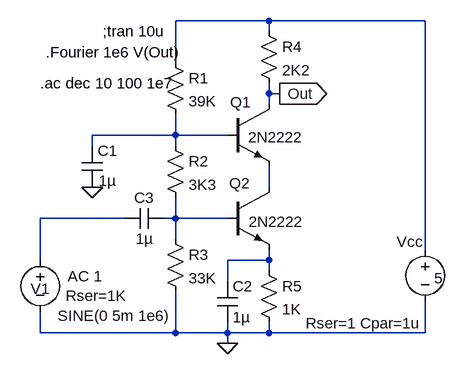
[diagram p0: schematic CascodAmp.asc]
CascodAmp.asc, the LTspice schematic file:
Version 4
SHEET 1 880 680
WIRE -320 400 -320 336
WIRE -320 512 -320 480
WIRE -240 224 -240 208
WIRE -192 336 -320 336
WIRE -112 96 -112 32
WIRE -112 208 -240 208
WIRE -112 208 -112 176
WIRE -112 224 -112 208
WIRE -112 336 -128 336
WIRE -112 336 -112 304
WIRE -112 368 -112 336
WIRE -112 512 -320 512
WIRE -112 512 -112 448
WIRE -32 208 -112 208
WIRE -32 336 -112 336
WIRE -32 432 -32 400
WIRE -32 512 -112 512
WIRE -32 512 -32 496
WIRE -32 528 -32 512
WIRE 32 32 -112 32
WIRE 32 48 32 32
WIRE 32 144 32 128
WIRE 32 160 32 144
WIRE 32 288 32 256
WIRE 32 400 -32 400
WIRE 32 400 32 384
WIRE 32 416 32 400
WIRE 32 512 -32 512
WIRE 32 512 32 496
WIRE 48 144 32 144
WIRE 272 32 32 32
WIRE 272 384 272 32
WIRE 272 512 32 512
WIRE 272 512 272 464
FLAG -240 288 0
FLAG -32 528 0
FLAG 48 144 Out
IOPIN 48 144 Out
SYMBOL res -128 80 R0
SYMATTR InstName R1
SYMATTR Value 39K
SYMATTR SpiceLine tol=1 pwr=0.1
SYMBOL res -128 208 R0
SYMATTR InstName R2
SYMATTR Value 3K3
SYMATTR SpiceLine tol=1 pwr=0.1
SYMBOL res -128 352 R0
SYMATTR InstName R3
SYMATTR Value 33K
SYMATTR SpiceLine tol=1 pwr=0.1
SYMBOL res 16 32 R0
SYMATTR InstName R4
SYMATTR Value 2K2
SYMATTR SpiceLine tol=1 pwr=0.1
SYMBOL npn -32 160 R0
WINDOW 0 4 -3 Left 0
WINDOW 3 32 51 Left 0
SYMATTR InstName Q1
SYMATTR Value 2N2222
SYMBOL cap -256 224 R0
WINDOW 3 26 54 Left 0
SYMATTR InstName C1
SYMATTR Value 1µ
SYMBOL npn -32 288 R0
WINDOW 0 3 -6 Left 0
WINDOW 3 33 53 Left 0
SYMATTR InstName Q2
SYMATTR Value 2N2222
SYMBOL res 16 400 R0
SYMATTR InstName R5
SYMATTR Value 1K
SYMATTR SpiceLine tol=1 pwr=0.1
SYMBOL cap -48 432 R0
SYMATTR InstName C2
SYMATTR Value 1µ
SYMBOL cap -128 320 R90
WINDOW 0 0 32 VBottom 0
WINDOW 3 32 32 VTop 0
SYMATTR InstName C3
SYMATTR Value 1µ
SYMBOL voltage -320 384 R0
WINDOW 0 -15 60 Left 0
WINDOW 3 27 102 Left 0
WINDOW 123 42 41 Left 0
WINDOW 39 39 71 Left 0
SYMATTR InstName V1
SYMATTR Value SINE(0 5m 1e6)
SYMATTR Value2 AC 1
SYMATTR SpiceLine Rser=1K
SYMBOL voltage 272 368 R0
WINDOW 0 -44 4 Left 0
WINDOW 3 14 60 Left 0
WINDOW 123 0 0 Left 0
WINDOW 39 -4 129 Right 0
SYMATTR InstName Vcc
SYMATTR Value 5
SYMATTR SpiceLine Rser=1 Cpar=1u
TEXT -224 48 Left 0 !;tran 10u
TEXT -312 80 Left 0 !.Fourier 1e6 V(Out)
TEXT -320 128 Left 0 !.ac dec 10 100 1e7

The netlist it stands for:
* CascodAmp.asc
R1 N003 N002 39K tol=1 pwr=0.1
R2 N002 N004 3K3 tol=1 pwr=0.1
R3 N004 0 33K tol=1 pwr=0.1
R4 N003 Out 2K2 tol=1 pwr=0.1
Q1 Out N002 N006 0 2N2222
C1 N002 0 1µ
Q2 N006 N004 N005 0 2N2222
R5 N005 0 1K tol=1 pwr=0.1
C2 N005 0 1µ
C3 N004 N001 1µ
V1 N001 0 SINE(0 5m 1e6) AC 1 Rser=1K
Vcc N003 0 5 Rser=1 Cpar=1u
.model NPN NPN
.model PNP PNP
.lib standard.bjt
;tran 10u
.Fourier 1e6 V(Out)
.ac dec 10 100 1e7
.backanno
.end